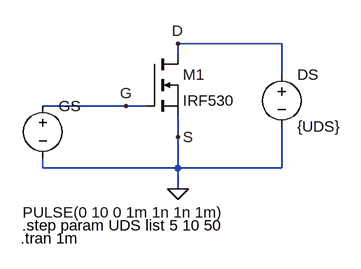
[diagram p0: schematic lab_00_Uebertragungskennlinie_Loesung.asc]
lab_00_Uebertragungskennlinie_Loesung.asc, the LTspice schematic file:
Version 4
SHEET 1 880 680
WIRE 352 80 192 80
WIRE 192 96 192 80
WIRE 352 128 352 80
WIRE 112 176 -16 176
WIRE 144 176 112 176
WIRE 192 224 192 192
WIRE -16 272 -16 256
WIRE 192 272 192 224
WIRE 192 272 -16 272
WIRE 352 272 352 208
WIRE 352 272 192 272
WIRE 192 304 192 272
FLAG 112 176 G
FLAG 192 80 D
FLAG 192 224 S
FLAG 192 304 0
SYMBOL nmos 144 96 R0
SYMATTR InstName M1
SYMATTR Value IRF530
SYMBOL voltage 352 112 R0
WINDOW 123 0 0 Left 0
WINDOW 39 0 0 Left 0
SYMATTR InstName DS
SYMATTR Value {UDS}
SYMBOL voltage -16 160 R0
WINDOW 3 -31 180 Left 2
WINDOW 123 0 0 Left 0
WINDOW 39 0 0 Left 0
SYMATTR InstName GS
SYMATTR Value PULSE(0 10 0 1m 1n 1n 1m)
TEXT -48 360 Left 2 !.step param UDS list 5 10 50
TEXT -50 380 Left 2 !.tran 1m

The netlist it stands for:
* lab_00_Uebertragungskennlinie_Loesung.asc
M1 D G 0 0 IRF530
V§DS D 0 {UDS}
V§GS G 0 PULSE(0 10 0 1m 1n 1n 1m)
.model NMOS NMOS
.model PMOS PMOS
.lib standard.mos
.step param UDS list 5 10 50
.tran 1m
.backanno
.end